# Altium schematic sheet Power.SchDoc
size A4
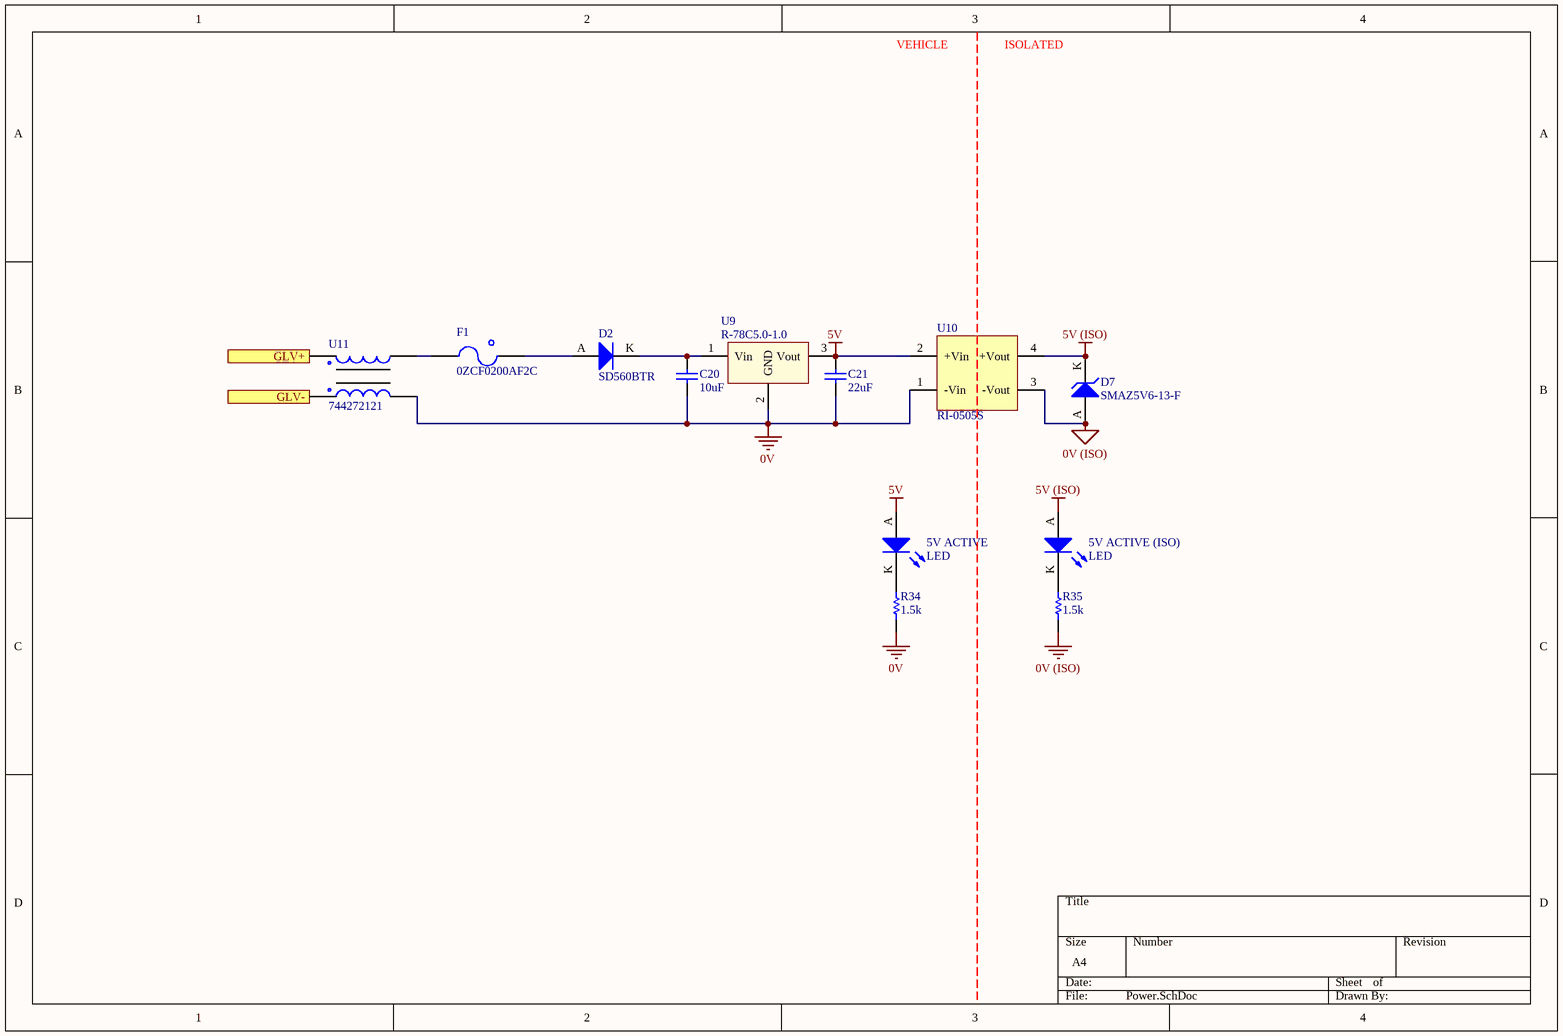
[diagram p0: Power.SchDoc]

## Parts
5V_ACTIVE  LED  [0805 LED]
5V_ACTIVE_(ISO)  LED  [0805 LED]
C20  10uF  [0805]
C21  22uF  [0805]
D2  SD560BTR  [SMB Diode]
D7  SMAZ5V6-13-F  [DI SMA Diode]
F1  0ZCF0200AF2C  [2920]
R34  1.5k  [0805]
R35  1.5k  [0805]
U9  R-78C5.0-1.0  [RECOM 3-SIP]
U10  RI-0505S  [RECOM 4-SIP]
U11  744272121  [Wurth 4-PC Pad]

## Ports
GLV+ (in), GLV- (in)

## Nets
0V: C20.1 C21.1 R34.1 U9.2(GND) U10.1(-Vin) U11.3
0V (ISO): D7.A R35.1 U10.3(-Vout)
5V: 5V_ACTIVE.A C21.2 U9.3(Vout) U10.2(+Vin)
5V (ISO): 5V_ACTIVE_(ISO).A D7.K U10.4(+Vout)
GLV+: U11.1 ; port GLV+
GLV-: U11.4 ; port GLV-
Net5V_ACTIVE_(ISO)_K: 5V_ACTIVE_(ISO).K R35.2
Net5V_ACTIVE_K: 5V_ACTIVE.K R34.2
NetC20_2: C20.2 D2.K U9.1(Vin)
NetD2_A: D2.A F1.2
NetF1_1: F1.1 U11.2

## Notes on the sheet
- VEHICLE
- ISOLATED

## Library data of the parts
5V_ACTIVE 5V_ACTIVE_(ISO) = SML-210LTT86: Red LED Indication - Discrete 1.75V 0805 (2012 Metric); Manufacturer: ROHM Semiconductor; Part Number: SML-210LTT86; Colour: Red; Digikey Part Number: 511-1286-1-ND; Digikey Link: https://www.digikey.com/product-detail/en/rohm-semiconductor/SML-210LTT86/511-1286-1-ND/637099
C20 = GRM21BR6YA106KE43L: Manufacturer: muRata; Tolerance: 10%; Material: X5R; Rated Voltage: 50V; Value: 10uF; Digikey Part Number: 490-10514-6-ND; Part Number: GRM21BR6YA106KE43L
C21 = GRM21BR61A226ME51L: Manufacturer: muRata; Tolerance: 20%; Material: X5R; Rated Voltage: 10V; Value: 22uF; Digikey Part Number: 490-10511-1-ND; Part Number: GRM21BR61A226ME51L
D2 = SD560BTR: 1.2V_F 600V 5A SMB; Manufacturer: SMC Diode Solutions; Part Number: SD560BTR; Digikey Part Number: 1655-1530-2-ND; Digikey Link: https://www.digikey.com/product-detail/en/smc-diode-solutions/SD560BTR/1655-1530-2-ND/6022620
D7 = SMAZ5V6-13-F: DIODE ZENER 5.6V 1W SMA; Manufacturer: Diodes Inc; Part Number: SMAZ5V6-13-F; Digikey Part Number: SMAZ5V6-FDICT-ND; Digikey Link: https://www.digikey.com/product-detail/en/diodes-incorporated/SMAZ5V6-13-F/SMAZ5V6-FDICT-ND/755500
F1 = 0ZCF0200AF2C: SMD 24V 2A Fuse; Manufacturer: Bel Fuse Inc; Part Number: 0ZCF0200AF2C; Digikey Part Number: 507-1749-2-ND; Digikey Link: https://www.digikey.com/product-detail/en/bel-fuse-inc/0ZCF0200AF2C/507-1749-2-ND/4156090
R34 R35 = RC0805FR071K5L: Manufacturer: YAGEO; Tolerance: 0.01; Rated Voltage: 0.125W; Part Number: RC0805FR071K5L; Value: 1.5k; Material: FR-07; qty: 50
U9 = R-78C5.0-1.0: CONV DC/DC 1A 5V OUT SIP VERT; Manufacturer: Recom; Part Number: R-78C5.0-1.0; Digikey Part Number: 945-1395-5-ND; Digikey Link: https://www.digikey.com.au/product-detail/en/recom-power/R-78C5.0-1.0/945-1395-5-ND/2652148
U10 = RI-0505S: 5V DC-DC Converter (2W); Manufacturer: Recom; Part Number: RI-0505S; Digikey Part Number: 945-1189-ND; Digikey Link: https://www.digikey.com/product-detail/en/recom-power/RI-0505S/945-1189-ND/2256369
U11 = 744272121: Common Mode Choke 120UH 2.5A 2LN 460 OHM SMD; Manufacturer: Wurth Electronics Inc; Part Number: 744272121; Digikey Part Number: 732-1489-2-ND; Digikey Link: https://www.digikey.com/product-detail/en/wurth-electronics-inc/744272121/732-1489-2-ND/1638893